# Altium project Task_Project.PrjPcb
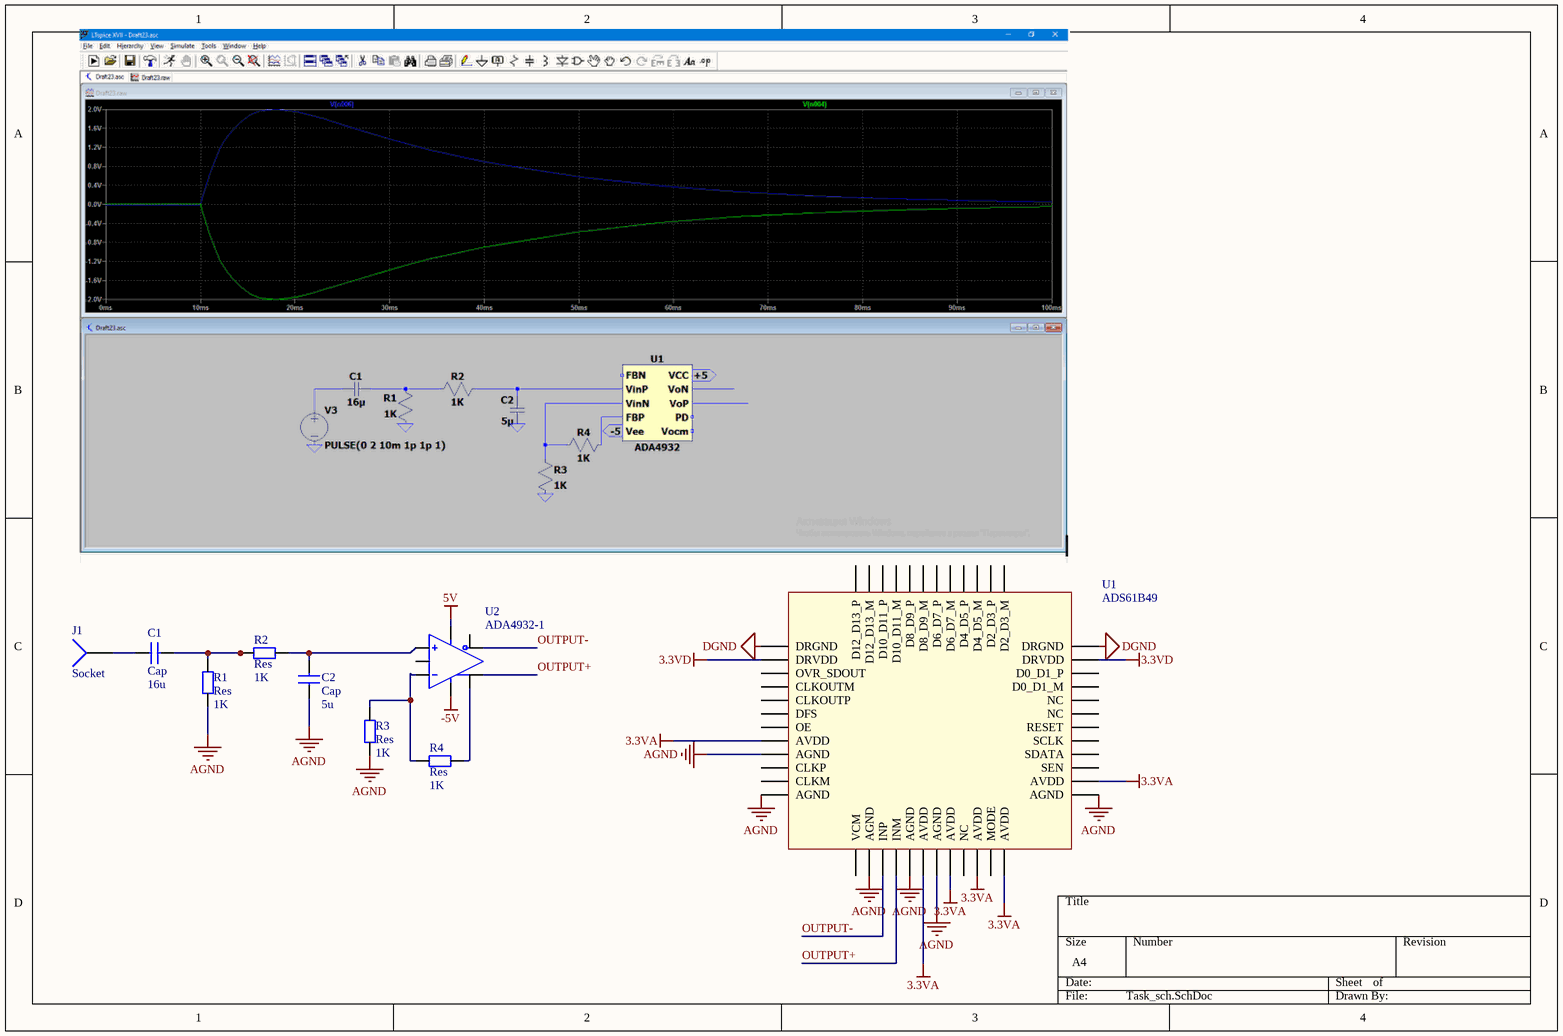
[diagram p0: Task_sch.SchDoc]
1 sheet, 9 parts. Net scope: global (net labels, ports and power ports of the same name join across sheets).
Board file: Task_PCB.PcbDoc

## Sheet Task_sch.SchDoc
size A4

### Parts
C1  Cap  value 16u  [0805]
C2  Cap  value 5u  [0805]
J1  Socket  [PIN1]
R1  Res  value 1K  [0805]
R2  Res  value 1K  [0805]
R3  Res  value 1K  [0805]
R4  Res  value 1K  [0805]
U1  ADS61B49  [ADS61B49]
U2  ADA4932-1  [ADA4932-1]

### Nets
3.3VA: U1.8(AVDD) U1.18(AVDD) U1.20(AVDD) U1.22(AVDD) U1.24(AVDD) U1.26(AVDD)
3.3VD: U1.2(DRVDD) U1.35(DRVDD)
5V: U2.13,14,15,16
-5V: U2.5,6,7,8
AGND: C2.1 R1.1 R3.2 U1.9(AGND) U1.12(AGND) U1.14(AGND) U1.17(AGND) U1.19(AGND) U1.25(AGND)
DGND: U1.1,49(DRGND) U1.36(DRGND)
OUTPUT+: U1.16(INM) U2.10
OUTPUT-: U1.15(INP) U2.11
NetC1_1: C1.1 J1.1
NetC1_2: C1.2 R1.2 R2.2
NetC2_2: C2.2 R2.1 U2.2
NetR3_1: R3.1 R4.2 U2.3
NetR4_1: R4.1 U2.4

Not connected (* = marked no-connect by the designer): U1 3(OVR_SDOUT) 4(CLKOUTM) 5(CLKOUTP) 6(DFS) 7(OE) 10(CLKP) 11(CLKM) 13(VCM) 21(NC) 23(MODE) 27(SEN) 28(SDATA) 29(SCLK) 30(RESET) 31(NC) 32(NC) 33(D0_D1_M) 34(D0_D1_P) 37(D2_D3_M) 38(D2_D3_P) 39(D4_D5_M) 40(D4_D5_P) 41(D6_D7_M) 42(D6_D7_P) 43(D8_D9_M) 44(D8_D9_P) 45(D10_D11_M) 46(D10_D11_P) 47(D12_D13_M) 48(D12_D13_P); U2 1 9(6)

### Library data of the parts
J1 = Socket: LatestRevisionDate: 17-Jul-2002; LatestRevisionNote: Re-released for DXP Platform.; Publisher: Altium Limited